# EAGLE schematic arduino101 (EAGLE 7.6.0)
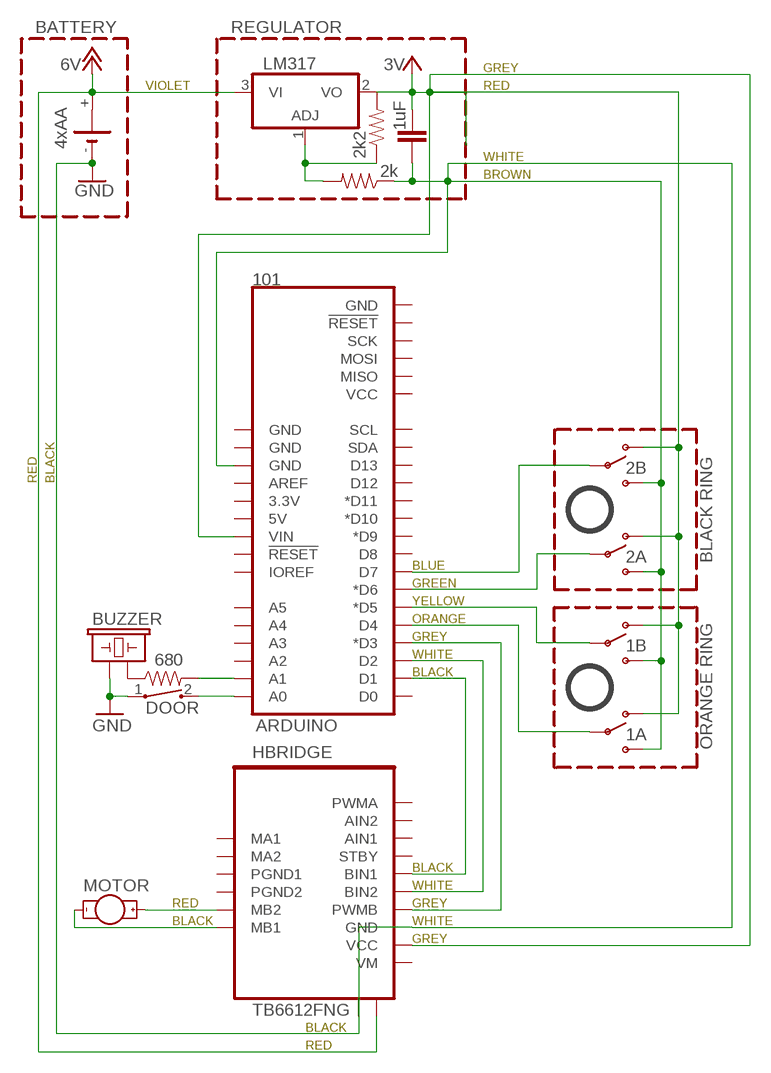
[diagram p0: schematic, sheet 1]

## Parts
1A  1A  SWITCH-SPDTPTH_LOCK  [SWITCH-SPDT_LOCK.007S]
1B-  1B  SWITCH-SPDTPTH_LOCK  [SWITCH-SPDT_LOCK.007S]
2A  2A  SWITCH-SPDTPTH_LOCK  [SWITCH-SPDT_LOCK.007S]
2B  2B  SWITCH-SPDTPTH_LOCK  [SWITCH-SPDT_LOCK.007S]
ARDUINO  ARDUINO_R3  [ARDUINO_R3]
BAT  4xAA  CRAA  [CRAA]
BUZZER  BUZZERPTH  [BUZZER-12MM]
C2  1uF  CAPPTH  [CAP-PTH-SMALL]
DOOR  CT10-XXXX-A2  [CT10-XXXX-A2]
HBRIDGE  TB6612FNG  [SSOP24]
LM317  317T  [TO220H]
MOTOR  MOTOR10MM  [VIBE-MOTOR-10MM]
R1  680  680OHM1/10W5%(0603)  [0603-RES]
R2  2k  RESISTOREZ  [AXIAL-0.3EZ]
R3  2k2  RESISTOREZ  [AXIAL-0.3EZ]

## Nets
1A: 1A.2(P) ARDUINO.D4
1B: 1B-.2(P) ARDUINO.D5(*D5)
2A: 2A.2(P) ARDUINO.D6(*D6)
2B: 2B.2(P) ARDUINO.D7
+3V3: 1A.1(O) 1B-.1(O) 2A.1(O) 2B.1(O) ARDUINO.VIN C2.2 HBRIDGE.20(VCC) LM317.2(VO) R3.P$2 ; supply symbol labelled 3V
+6V: BAT.+ HBRIDGE.13(VM+) LM317.3(VI) ; supply symbol labelled 6V
BIN1: ARDUINO.D1 HBRIDGE.17(BIN1)
BIN2: ARDUINO.D2 HBRIDGE.16(BIN2)
BLACK_GND: BUZZER.+ DOOR.1 ; supply symbol labelled GND
BLACK_OUT: HBRIDGE.11(MB1) MOTOR.-
GND: 1A.3(S) 1B-.3(S) 2A.3(S) 2B.3(S) ARDUINO.GND@4(GND) BAT.- C2.1 HBRIDGE.10(VM-) HBRIDGE.18(GND) R2.P$1
MB2: HBRIDGE.7(MB2) MOTOR.+
N$1: LM317.1(ADJ) R2.P$2 R3.P$1
N$2: ARDUINO.A1 R1.2
N$3: ARDUINO.A0 DOOR.2
N$4: BUZZER.- R1.1
PWMB: ARDUINO.D3(*D3) HBRIDGE.15(PWMB)
Unconnected: ARDUINO.3.3V ARDUINO.5V ARDUINO.A2 ARDUINO.A3 ARDUINO.A4 ARDUINO.A5 ARDUINO.AREF ARDUINO.D0 ARDUINO.D8 ARDUINO.D9(*D9) ARDUINO.D10(*D10) ARDUINO.D11(*D11) ARDUINO.D12 ARDUINO.D13 ARDUINO.GND@1(GND) ARDUINO.GND@2(GND) ARDUINO.GND@3(GND) ARDUINO.IOREF ARDUINO.MISO ARDUINO.MOSI ARDUINO.RESET@1(!RESET!) ARDUINO.RESET@2(!RESET!) ARDUINO.SCK ARDUINO.SCL ARDUINO.SDA ARDUINO.VCC BAT.+@1(+) HBRIDGE.1(MA1) HBRIDGE.5(MA2) HBRIDGE.19(STBY) HBRIDGE.21(AIN1) HBRIDGE.22(AIN2) HBRIDGE.23(PWMA)

## Notes on the sheet
- BATTERY | REGULATOR
- GREY
- VIOLET | RED
- WHITE
- BROWN
- BLACK RING
- RED | BLACK
- BLUE
- GREEN
- YELLOW
- ORANGE
- GREY
- WHITE
- BLACK
- ORANGE RING
- BLACK
- WHITE
- RED | GREY
- BLACK | WHITE
- GREY
- BLACK
- RED

## Power pins joined to a net without a drawn wire
PGND1: HBRIDGE.3(PGND1)
PGND2: HBRIDGE.9(PGND2)
VM: HBRIDGE.24(VM)

## Library data of the parts
1A 1B- 2A 2B = SparkFun-Electromechanical:SWITCH-SPDT: SPDT Switch Simple slide switch, Spark Fun Electronics SKU : COM-00102 DPDT SMT slide switch, AYZ0202, SWCH-08179
ARDUINO = SparkFun-Boards:ARDUINO_R3: Arduino R3 Footprint (w/ SPI header)
BAT = battery:CRAA: LI BATTERY Varta
BUZZER = SparkFun-Electromechanical:BUZZER: Buzzer 12mm Spark Fun Electronics SKU : Comp-Buzzer
C2 = SparkFun-Passives:CAP: Capacitor Standard 0603 ceramic capacitor, and 0.1" leaded capacitor.
DOOR = switch-coto:CT10-XXXX-: CT10 Series Molded Switch Source: www.cotorelay.com .. Coto_Technology__CT10-1530-G1.pdf
HBRIDGE = SparkFun-PowerIC:TB6612FNG: Toshiba 1A dual motor driver IC-09363; PROD_ID: IC-09363
LM317 = linear:*317: Positive VOLTAGE REGULATOR
MOTOR = SparkFun-Electromechanical:MOTOR: Vibration Motor- ROB-08449 Physical dimension and wire connections for this powerful vibration motor. Motor has a self adhesive backing.
R1 = SparkFun-Resistors:680OHM1/10W5%(0603): RES-09333; PROD_ID: RES-09333
R2 R3 = SparkFun-Passives:RESISTOR: Resistor Basic schematic elements and footprints for 0603, 1206, and PTH resistors.